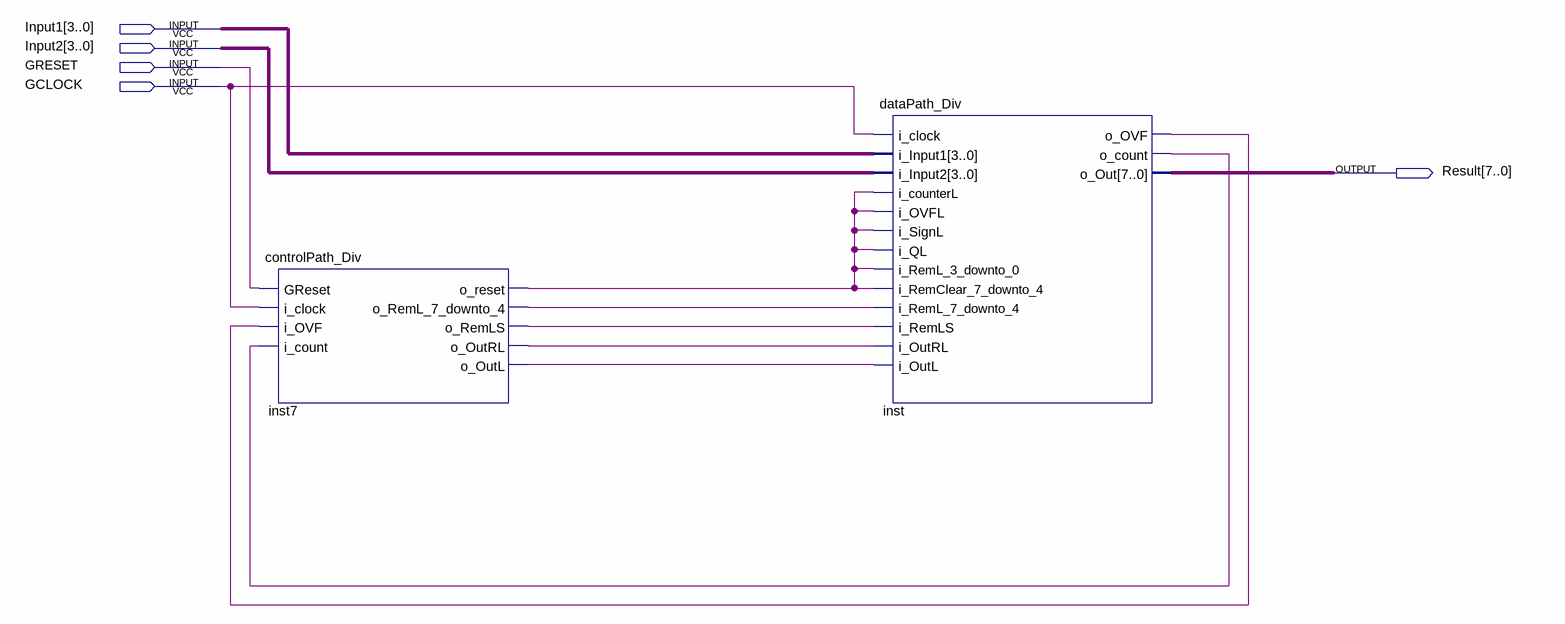
[diagram p0: schematic sheet]
// Quartus schematic topLevel_Div.bdf as structural Verilog: 2 symbols, 5 pins
module topLevel_Div (
  input  [3:0] Input1,
  input  [3:0] Input2,
  input  GRESET,
  input  GCLOCK,
  output [7:0] Result
);

  wire inst7_o_outl, inst7_o_outrl, inst7_o_reml_7_downto_4, inst7_o_remls, inst7_o_reset, inst_o_count,
       inst_o_ovf;

  controlPath_Div inst7 (
    .GReset(GRESET), .i_clock(GCLOCK), .i_OVF(inst_o_ovf), .i_count(inst_o_count), .o_reset(inst7_o_reset),
    .o_RemL_7_downto_4(inst7_o_reml_7_downto_4), .o_RemLS(inst7_o_remls), .o_OutRL(inst7_o_outrl),
    .o_OutL(inst7_o_outl));
  dataPath_Div inst (
    .i_clock(GCLOCK), .i_Input1(Input1), .i_Input2(Input2), .i_counterL(inst7_o_reset),
    .i_OVFL(inst7_o_reset), .i_SignL(inst7_o_reset), .i_QL(inst7_o_reset), .i_RemL_3_downto_0(inst7_o_reset),
    .i_RemClear_7_downto_4(inst7_o_reset), .i_RemL_7_downto_4(inst7_o_reml_7_downto_4),
    .i_RemLS(inst7_o_remls), .i_OutRL(inst7_o_outrl), .i_OutL(inst7_o_outl), .o_OVF(inst_o_ovf),
    .o_count(inst_o_count), .o_Out(Result));
endmodule
